# Altium schematic sheet Power.SchDoc: POWER
size A4; Organization: Altium Limited; Address1: L3, 12a Rodborough Rd; Address2: Frenchs Forest; Address3: NSW; Address4: Australia 2086; Stage: DRAFT
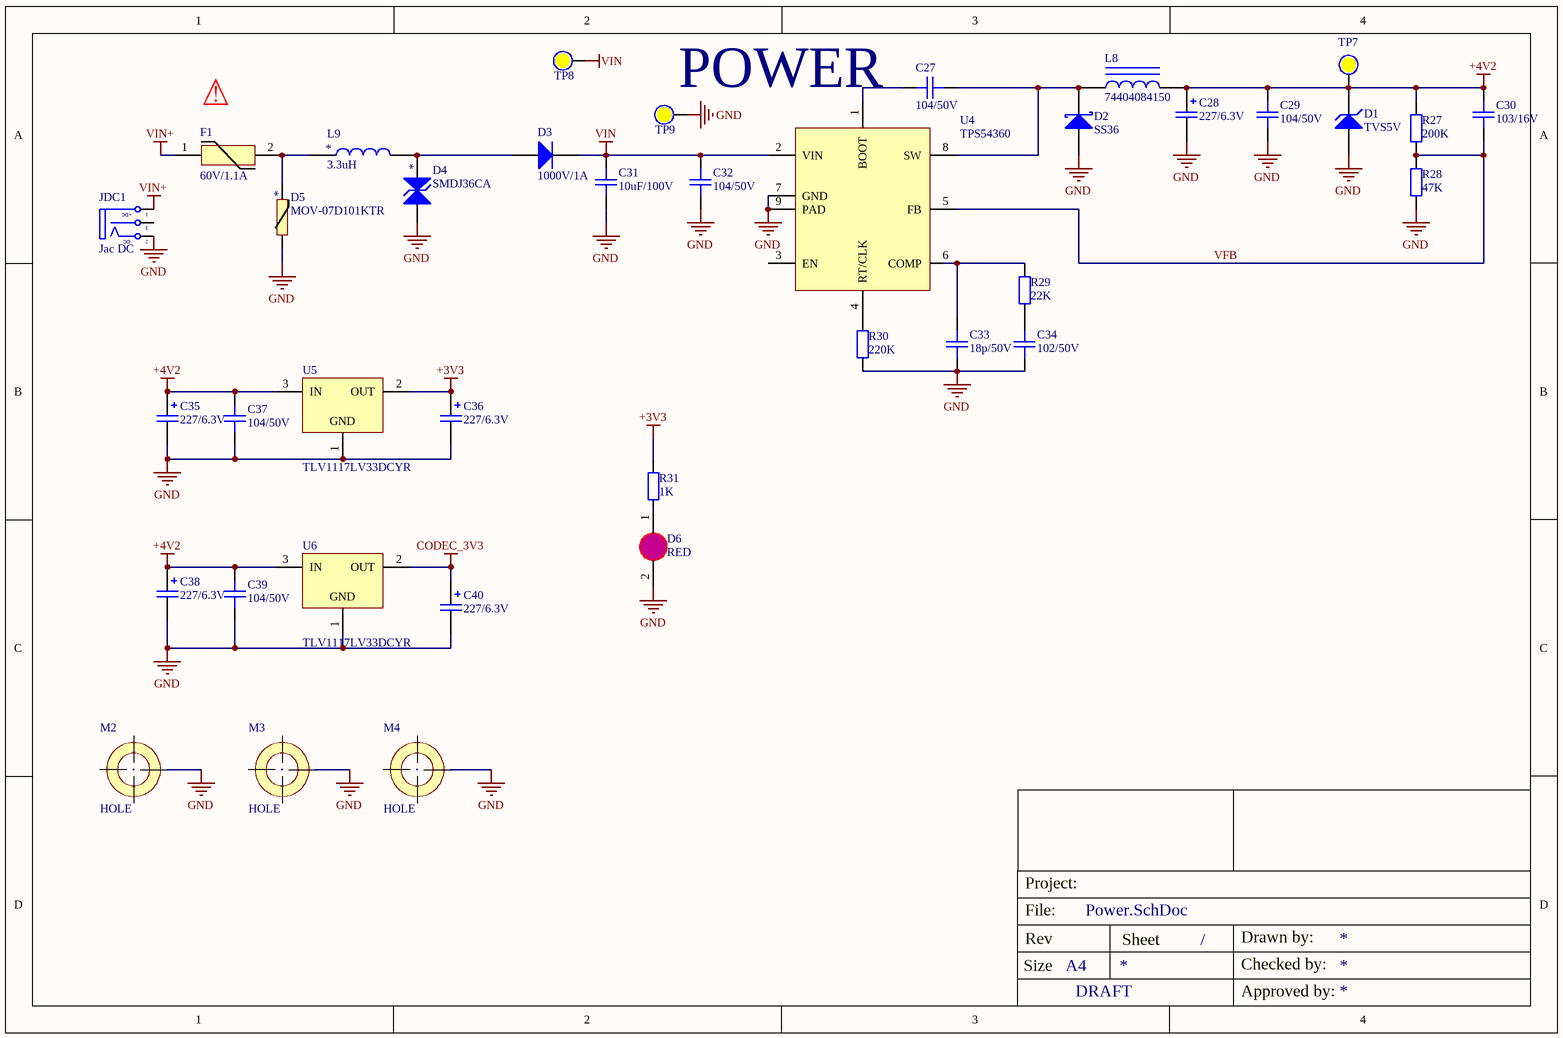
[diagram p0: Power.SchDoc]

## Parts
C27  104/50V  [CAPC-0603 (1608)]
C28  227/6.3V  [CAP_TANTAL_1210(3528)]
C29  104/50V  [CAPC-0603 (1608)]
C30  103/16V  [CAPC-0603 (1608)]
C31  10uF/100V  [CAPC-2220 (5750)]
C32  104/50V  [CAPC-0603 (1608)]
C33  18p/50V  [CAPC-0603 (1608)]
C34  102/50V  [CAPC-0603 (1608)]
C35  227/6.3V  [CAP_TANTAL_1210(3528)]
C36  227/6.3V  [CAP_TANTAL_1210(3528)]
C37  104/50V  [CAPC-0603 (1608)]
C38  227/6.3V  [CAP_TANTAL_1210(3528)]
C39  104/50V  [CAPC-0603 (1608)]
C40  227/6.3V  [CAP_TANTAL_1210(3528)]
D1  TVS5V  [DIODE_DO214AC_SMA]
D2  SS36  [DIODE_DO214AC_SMA]
D3  1000V/1A  [DIODE_DO214AC_SMA]
D4  SMDJ36CA  [DIODE_DO214AB_SMC]
D5  MOV-07D101KTR  [MOV-07D101KTR]
D6  RED  [LED_0805_RED]
F1  60V/1.1A  [RKEF110]
JDC1  Jac DC  [DC0]
L8  74404084150  [IND-74404084150]
L9  3.3uH  [IND-CD74-7x7x4MM]
M2  HOLE  [HOLE_3MM_6MM]  (no BOM)
M3  HOLE  [HOLE_3MM_6MM]  (no BOM)
M4  HOLE  [HOLE_3MM_6MM]  (no BOM)
R27  200K  [RESC-0603 (1608)]
R28  47K  [RESC-0603 (1608)]
R29  22K  [RESC-0603 (1608)]
R30  220K  [RESC-0603 (1608)]
R31  1K  [RESC-0603 (1608)]
TP7  (no value)  [Test Point 1.5 MM]  (no BOM)
TP8  (no value)  [Test Point 1.5 MM]  (no BOM)
TP9  (no value)  [Test Point 1.5 MM]  (no BOM)
U4  TPS54360  [SOIC8 - POWER]
U5  TLV1117LV33DCYR  [SOT-223-4]
U6  TLV1117LV33DCYR  [SOT-223-4]

## Nets
+3V3: C36.1 R31.2 U5.2(OUT)
+4V2: C28.1 C29.2 C30.2 C35.1 C37.1 C38.1 C39.1 D1.2(K) L8.2 R27.2 TP7.0 U5.3(IN) U6.3(IN)
CODEC_3V3: C40.1 U6.2(OUT)
GND: C28.2 C29.1 C31.1 C32.1 C33.1 C34.1 C35.2 C36.2 C37.2 C38.2 C39.2 C40.2 D1.1(A) D2.1(A) D4.1(A) D5.1(A) D6.2(K) JDC1.2(TN) R28.1 R30.1 TP9.0 U4.7(GND) U4.9(PAD) U5.1(GND) U6.1(GND)
VIN: C31.2 C32.2 D3.2(K) TP8.0 U4.2(VIN)
VIN+: F1.1 JDC1.1(T)
VFB: C30.1 R27.1 R28.2 U4.5(FB)
NetC27_1: C27.1 D2.2(K) L8.1 U4.8(SW)
NetC27_2: C27.2 U4.1(BOOT)
NetC33_2: C33.2 R29.2 U4.6(COMP)
NetC34_2: C34.2 R29.1
NetD3_1: D3.1(A) D4.2(K) L9.2
NetD5_2: D5.2(K) F1.2 L9.1
NetD6_1: D6.1(A) R31.1
NetR30_2: R30.2 U4.4(RT/CLK)

Not connected (* = marked no-connect by the designer): JDC1 3(S); U4 3(EN)

## Notes on the sheet
- (near F1) ⚠
- Project:
- File:
- Size
- Rev
- A4
- Sheet
- /
- Drawn by:
- Checked by:
- Approved by:
- (in symbol DCIN) +DC; -DC

## Library data of the parts
C27 C29 C32 C37 C39 = C0603C104K5RACTU: CAP CER 0.1uF 50V 10% X7R 0603; CompanyID: VT-00982; Solder: SMT; MPN: C0603C104K5RACTU; Value: 104/50V; Category: CAPACITOR
C28 C35 C36 C38 C40 = T520B227M006ATE035: CAP TANT POLY 220uF 20% 6.3V 3528 35mOhm ESR; Solder: SMT; CompanyID: VT-00643; Value: 227/6.3V; MPN: T520B227M006ATE035; Category: CAPACITOR
C30 = CC0603KRX7R7BB103: CAP CER 10nF 16V 10% X7R 0603; CompanyID: VT-00592; Solder: SMT; MPN: CC0603KRX7R7BB103; Value: 103/16V; Category: CAPACITOR
C31 = 22201C106MAT2A: CAP CER 10UF 100V X7R 2220; MFR: AVX Corporation; Solder: SMT; MPN: 22201C106MAT2A; Value: 10uF/100V; Category: CAPACITOR; PinCount: 2
C33 = CL10C180JB8NNNC: CAP CER 18pF 5% 50V C0G/NP0 0603; CompanyID: VT-00985; Solder: SMT; Value: 18p/50V; MPN: CL10C180JB8NNNC; Category: CAPACITOR
C34 = C0603C102K5RACTU: CAP CER 1nF 50V 10% X7R 0603; CompanyID: VT-00573; Solder: SMT; MPN: C0603C102K5RACTU; Value: 102/50V; Category: CAPACITOR
D1 = SMAJ5.0A-E3/61: DIODE TVS 5VWM 9.2VC SMA; Value: 9.2V/43.5A; Solder: SMT; CompanyID: VT-00317; MPN: SMAJ5.0A-E3/61
D2 = B340A-E3/61T: DIODE SCHOTTKY 60V 3A DO214AC; Value: 60V/3A; Solder: SMT; MPN: SS36
D3 = 1N4007_SMA: DIODE GEN PURP 1KV 1A SMA; MPN: MRA4007T3G; Solder: SMT; Value: 1000V/1A; MFR: *
D4 = SMDJ36CA: DIODE TVS 36VWM 58.1VC 3KW SMD; CompanyID: VT00550; Solder: SMT; Value: SMDJ36CA; MPN: SMDJ36CA
D5 = MOV-07D101KTR: VARISTOR 100V 1.2KA DISC 7MM; Solder: SMT; Value: MOV-07D101KTR; MPN: MOV-07D101KTR
D6 = 17-215SURC/S530-A3/TR8: LED RED CLEAR 0805 SMD; Solder: SMT; CompanyID: VT-00379; Value: RED; MPN: 17-215SURC/S530-A3/TR8
F1 = RKEF110: PTC RESET FUSE 60V 1.1A RADIAL; MFR: Littelfuse Inc.; Solder: WAVE; MPN: RKEF110; Value: 60V/1.1A
JDC1 = DCIN: Jac DC input; Value: Jac DC
L8 = SRR1260-150MCT-ND: FIXED IND 15UH 2.6A 47 MOHM SMD; MFR: Würth Elektronik; MPN: 74404084150; Category: INDUCTOR
L9 = CD74_3U3: IND-FIXED 3.3uH CD74 7.4 x 7.4 x 4 MM; Solder: SMT; MPN: CD74_3U3; Value: 3.3uH; Category: INDUCTOR; PinCount: 2
M2-M4 = HOLE_3_5: 3mm/5mm; MPN: None; Solder: Not Fill; CompanyID: VT-; ClassName: MECH_HOLE; Value: HOLE
R27 = RC0603FR-07220KL: RES SMD 200K OHM 1% 1/10W 0603; MPN: RC0603FR-07200KL; CompanyID: VT-00761; Solder: SMT; Value: 200K; Category: RESISTOR
R28 = RC0603FR0747KL: RES SMD 47K OHM 1% 1/10W 0603; CompanyID: VT-00322; Solder: SMT; Value: 47K; MPN: RC0603FR0747KL; Category: RESISTOR
R29 = RC0603FR-0722KL: RES SMD 22K OHM 1% 1/10W 0603; Solder: SMT; CompanyID: VT-00320; Value: 22K; MPN: RC0603FR-0722KL; Category: RESISTOR
R30 = RC0603FR-07220KL: RES SMD 220K OHM 1% 1/10W 0603; Solder: SMT; MPN: RC0603FR-07220KL; Value: 220K; Category: RESISTOR
R31 = RC0603FR-071KL: RES SMD 1 KOHM 1% 1/10W 0603; CompanyID: VT-00574; Solder: SMT; MPN: RC0603FR-071KL; Value: 1K; Category: RESISTOR
TP7-TP9 = Test Point: Solder: NF
U4 = TPS54360: 60 V Input, 3.5 A, step down regulator with an integrated high side MOSFET; Brand: TI; 1: xx; Part Number: TPS54360
U5 U6 = TLV1117LV33: Single Output LDO, 1 A, Fixed 3.3 V Output, 2 to 5.5 V Input, 4-pin SOT-223 (DCY), -40 to 125 degC, Green (RoHS & no Sb/Br); MFR: Texas Instruments; Solder: SMT; CompanyID: VT00286; MPN: TLV1117LV33DCYR; Value: TLV1117LV33; Category: IC